# EAGLE schematic SchematicBMS_ADI (EAGLE 9.7.0)

## Sheet 1 of 2
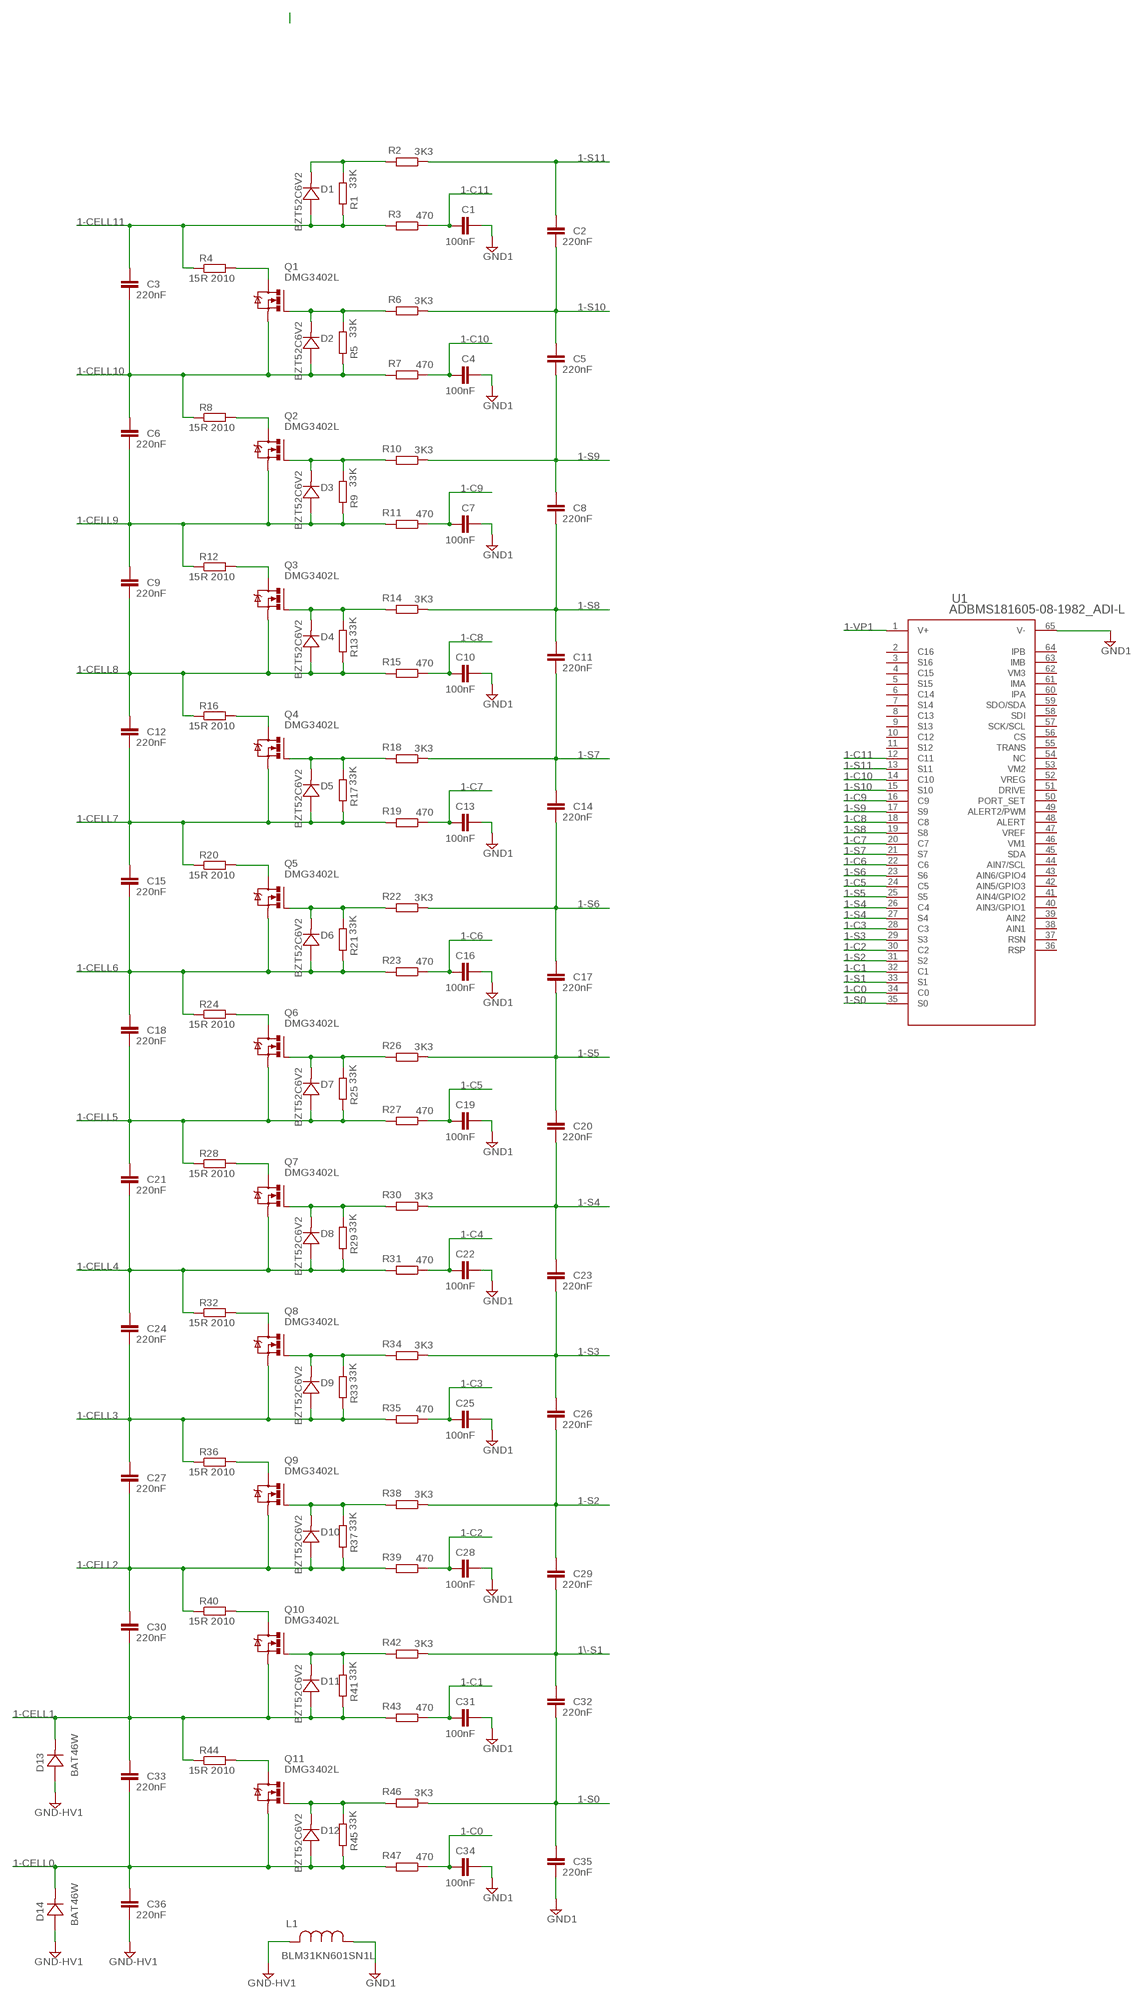
[diagram p0: schematic, sheet 1]

### Parts
C1  100nF  C-EUC0805K  [C0805K]
C2  220nF  C-EUC0805K  [C0805K]
C3  220nF  C-EUC0805K  [C0805K]
C4  100nF  C-EUC0805K  [C0805K]
C5  220nF  C-EUC0805K  [C0805K]
C6  220nF  C-EUC0805K  [C0805K]
C7  100nF  C-EUC0805K  [C0805K]
C8  220nF  C-EUC0805K  [C0805K]
C9  220nF  C-EUC0805K  [C0805K]
C10  100nF  C-EUC0805K  [C0805K]
C11  220nF  C-EUC0805K  [C0805K]
C12  220nF  C-EUC0805K  [C0805K]
C13  100nF  C-EUC0805K  [C0805K]
C14  220nF  C-EUC0805K  [C0805K]
C15  220nF  C-EUC0805K  [C0805K]
C16  100nF  C-EUC0805K  [C0805K]
C17  220nF  C-EUC0805K  [C0805K]
C18  220nF  C-EUC0805K  [C0805K]
C19  100nF  C-EUC0805K  [C0805K]
C20  220nF  C-EUC0805K  [C0805K]
C21  220nF  C-EUC0805K  [C0805K]
C22  100nF  C-EUC0805K  [C0805K]
C23  220nF  C-EUC0805K  [C0805K]
C24  220nF  C-EUC0805K  [C0805K]
C25  100nF  C-EUC0805K  [C0805K]
C26  220nF  C-EUC0805K  [C0805K]
C27  220nF  C-EUC0805K  [C0805K]
C28  100nF  C-EUC0805K  [C0805K]
C29  220nF  C-EUC0805K  [C0805K]
C30  220nF  C-EUC0805K  [C0805K]
C31  100nF  C-EUC0805K  [C0805K]
C32  220nF  C-EUC0805K  [C0805K]
C33  220nF  C-EUC0805K  [C0805K]
C34  100nF  C-EUC0805K  [C0805K]
C35  220nF  C-EUC0805K  [C0805K]
C36  220nF  C-EUC0805K  [C0805K]
D1  BZT52C6V2  BZT52C6V2-7-FSOD123_DIO  [SOD123_DIO]
D2  BZT52C6V2  BZT52C6V2-7-FSOD123_DIO  [SOD123_DIO]
D3  BZT52C6V2  BZT52C6V2-7-FSOD123_DIO  [SOD123_DIO]
D4  BZT52C6V2  BZT52C6V2-7-FSOD123_DIO  [SOD123_DIO]
D5  BZT52C6V2  BZT52C6V2-7-FSOD123_DIO  [SOD123_DIO]
D6  BZT52C6V2  BZT52C6V2-7-FSOD123_DIO  [SOD123_DIO]
D7  BZT52C6V2  BZT52C6V2-7-FSOD123_DIO  [SOD123_DIO]
D8  BZT52C6V2  BZT52C6V2-7-FSOD123_DIO  [SOD123_DIO]
D9  BZT52C6V2  BZT52C6V2-7-FSOD123_DIO  [SOD123_DIO]
D10  BZT52C6V2  BZT52C6V2-7-FSOD123_DIO  [SOD123_DIO]
D11  BZT52C6V2  BZT52C6V2-7-FSOD123_DIO  [SOD123_DIO]
D12  BZT52C6V2  BZT52C6V2-7-FSOD123_DIO  [SOD123_DIO]
D13  BAT46W  BAT46W-7-FSOD123_DIO  [SOD123_DIO]
D14  BAT46W  BAT46W-7-FSOD123_DIO  [SOD123_DIO]
L1  BLM31KN601SN1L  BLM31KN102SH1LIND_BLM31KN102SH1_MUR  [IND_BLM31KN102SH1_MUR]
Q1  DMG3402L  NMOSFETSOT23-GSD  [SOT23]
Q2  DMG3402L  NMOSFETSOT23-GSD  [SOT23]
Q3  DMG3402L  NMOSFETSOT23-GSD  [SOT23]
Q4  DMG3402L  NMOSFETSOT23-GSD  [SOT23]
Q5  DMG3402L  NMOSFETSOT23-GSD  [SOT23]
Q6  DMG3402L  NMOSFETSOT23-GSD  [SOT23]
Q7  DMG3402L  NMOSFETSOT23-GSD  [SOT23]
Q8  DMG3402L  NMOSFETSOT23-GSD  [SOT23]
Q9  DMG3402L  NMOSFETSOT23-GSD  [SOT23]
Q10  DMG3402L  NMOSFETSOT23-GSD  [SOT23]
Q11  DMG3402L  NMOSFETSOT23-GSD  [SOT23]
R1  33K  R-EU_R0805  [R0805]
R2  3K3  R-EU_R0805  [R0805]
R3  470  R-EU_R0805  [R0805]
R4  15R 2010  R-EU_R2010  [R2010]
R5  33K  R-EU_R0805  [R0805]
R6  3K3  R-EU_R0805  [R0805]
R7  470  R-EU_R0805  [R0805]
R8  15R 2010  R-EU_R2010  [R2010]
R9  33K  R-EU_R0805  [R0805]
R10  3K3  R-EU_R0805  [R0805]
R11  470  R-EU_R0805  [R0805]
R12  15R 2010  R-EU_R2010  [R2010]
R13  33K  R-EU_R0805  [R0805]
R14  3K3  R-EU_R0805  [R0805]
R15  470  R-EU_R0805  [R0805]
R16  15R 2010  R-EU_R2010  [R2010]
R17  33K  R-EU_R0805  [R0805]
R18  3K3  R-EU_R0805  [R0805]
R19  470  R-EU_R0805  [R0805]
R20  15R 2010  R-EU_R2010  [R2010]
R21  33K  R-EU_R0805  [R0805]
R22  3K3  R-EU_R0805  [R0805]
R23  470  R-EU_R0805  [R0805]
R24  15R 2010  R-EU_R2010  [R2010]
R25  33K  R-EU_R0805  [R0805]
R26  3K3  R-EU_R0805  [R0805]
R27  470  R-EU_R0805  [R0805]
R28  15R 2010  R-EU_R2010  [R2010]
R29  33K  R-EU_R0805  [R0805]
R30  3K3  R-EU_R0805  [R0805]
R31  470  R-EU_R0805  [R0805]
R32  15R 2010  R-EU_R2010  [R2010]
R33  33K  R-EU_R0805  [R0805]
R34  3K3  R-EU_R0805  [R0805]
R35  470  R-EU_R0805  [R0805]
R36  15R 2010  R-EU_R2010  [R2010]
R37  33K  R-EU_R0805  [R0805]
R38  3K3  R-EU_R0805  [R0805]
R39  470  R-EU_R0805  [R0805]
R40  15R 2010  R-EU_R2010  [R2010]
R41  33K  R-EU_R0805  [R0805]
R42  3K3  R-EU_R0805  [R0805]
R43  470  R-EU_R0805  [R0805]
R44  15R 2010  R-EU_R2010  [R2010]
R45  33K  R-EU_R0805  [R0805]
R46  3K3  R-EU_R0805  [R0805]
R47  470  R-EU_R0805  [R0805]
U1  ADBMS181605-08-1982_ADI-L  [05-08-1982_ADI-L]

### Nets
1-C0: C34.1 R47.1 U1.34(C0)
1-C1: C31.1 R43.1 U1.32(C1)
1-C2: C28.1 R39.1 U1.30(C2)
1-C3: C25.1 R35.1 U1.28(C3)
1-C4: C22.1 R31.1
1-C5: C19.1 R27.1 U1.24(C5)
1-C6: C16.1 R23.1 U1.22(C6)
1-C7: C13.1 R19.1 U1.20(C7)
1-C8: C10.1 R15.1 U1.18(C8)
1-C9: C7.1 R11.1 U1.16(C9)
1-C10: C4.1 R7.1 U1.14(C10)
1-C11: C1.1 R3.1 U1.12(C11)
1-CELL0: C33.1 C36.2 D12.2 D14.1 Q11.2(S) R45.1 R47.2
1-CELL1: C30.1 C33.2 D11.2 D13.1 Q10.2(S) R41.1 R43.2 R44.1
1-CELL2: C27.1 C30.2 D10.2 Q9.2(S) R37.1 R39.2 R40.1
1-CELL3: C24.1 C27.2 D9.2 Q8.2(S) R33.1 R35.2 R36.1
1-CELL4: C21.1 C24.2 D8.2 Q7.2(S) R29.1 R31.2 R32.1
1-CELL5: C18.1 C21.2 D7.2 Q6.2(S) R25.1 R27.2 R28.1
1-CELL6: C15.1 C18.2 D6.2 Q5.2(S) R21.1 R23.2 R24.1
1-CELL7: C12.1 C15.2 D5.2 Q4.2(S) R17.1 R19.2 R20.1
1-CELL8: C9.1 C12.2 D4.2 Q3.2(S) R13.1 R15.2 R16.1
1-CELL9: C6.1 C9.2 D3.2 Q2.2(S) R9.1 R11.2 R12.1
1-CELL10: C3.1 C6.2 D2.2 Q1.2(S) R5.1 R7.2 R8.1
1-CELL11: C3.2 D1.2 R1.1 R3.2 R4.1
1-S0: C32.1 C35.2 R46.1 U1.35(S0)
1-S1: U1.33(S1)
1-S2: C26.1 C29.2 R38.1 U1.31(S2)
1-S3: C23.1 C26.2 R34.1 U1.29(S3)
1-S4: C20.1 C23.2 R30.1 U1.26(C4) U1.27(S4)
1-S5: C17.1 C20.2 R26.1 U1.25(S5)
1-S6: C14.1 C17.2 R22.1 U1.23(S6)
1-S7: C11.1 C14.2 R18.1 U1.21(S7)
1-S8: C8.1 C11.2 R14.1 U1.19(S8)
1-S9: C5.1 C8.2 R10.1 U1.17(S9)
1-S10: C2.1 C5.2 R6.1 U1.15(S10)
1-S11: C2.2 R2.1 U1.13(S11)
1-VP1: U1.1(V+)
1\-S1: C29.1 C32.2 R42.1
GND1: C1.2 C4.2 C7.2 C10.2 C13.2 C16.2 C19.2 C22.2 C25.2 C28.2 C31.2 C34.2 C35.1 L1.1 U1.65(V-)
GND2: C36.1 D13.2 D14.2 L1.2 ; supply symbol labelled GND-HV1 ; also sheet 2
N$2: D1.1 R1.2 R2.2
N$3: Q1.3(D) R4.2
N$4: D2.1 Q1.1(G) R5.2 R6.2
N$5: Q2.3(D) R8.2
N$6: D3.1 Q2.1(G) R9.2 R10.2
N$7: Q3.3(D) R12.2
N$8: D4.1 Q3.1(G) R13.2 R14.2
N$9: Q4.3(D) R16.2
N$10: D5.1 Q4.1(G) R17.2 R18.2
N$11: Q5.3(D) R20.2
N$12: D6.1 Q5.1(G) R21.2 R22.2
N$13: Q6.3(D) R24.2
N$14: D7.1 Q6.1(G) R25.2 R26.2
N$15: Q7.3(D) R28.2
N$16: D8.1 Q7.1(G) R29.2 R30.2
N$17: Q8.3(D) R32.2
N$18: D9.1 Q8.1(G) R33.2 R34.2
N$19: Q9.3(D) R36.2
N$20: D10.1 Q9.1(G) R37.2 R38.2
N$21: Q10.3(D) R40.2
N$23: D11.1 Q10.1(G) R41.2 R42.2
N$24: Q11.3(D) R44.2
N$25: D12.1 Q11.1(G) R45.2 R46.2
Unconnected: U1.2(C16) U1.3(S16) U1.4(C15) U1.5(S15) U1.6(C14) U1.7(S14) U1.8(C13) U1.9(S13) U1.10(C12) U1.11(S12) U1.36(RSP) U1.37(RSN) U1.38(AIN1) U1.39(AIN2) U1.40(AIN3/GPIO1) U1.41(AIN4/GPIO2) U1.42(AIN5/GPIO3) U1.43(AIN6/GPIO4) U1.44(AIN7/SCL) U1.45(SDA) U1.46(VM1) U1.47(VREF) U1.48(ALERT) U1.49(ALERT2/PWM) U1.50(PORT_SET) U1.51(DRIVE) U1.52(VREG) U1.53(VM2) U1.54(NC) U1.55(TRANS) U1.56(CS) U1.57(SCK/SCL) U1.58(SDI) U1.59(SDO/SDA) U1.60(IPA) U1.61(IMA) U1.62(VM3) U1.63(IMB) U1.64(IPB)

## Sheet 2 of 2
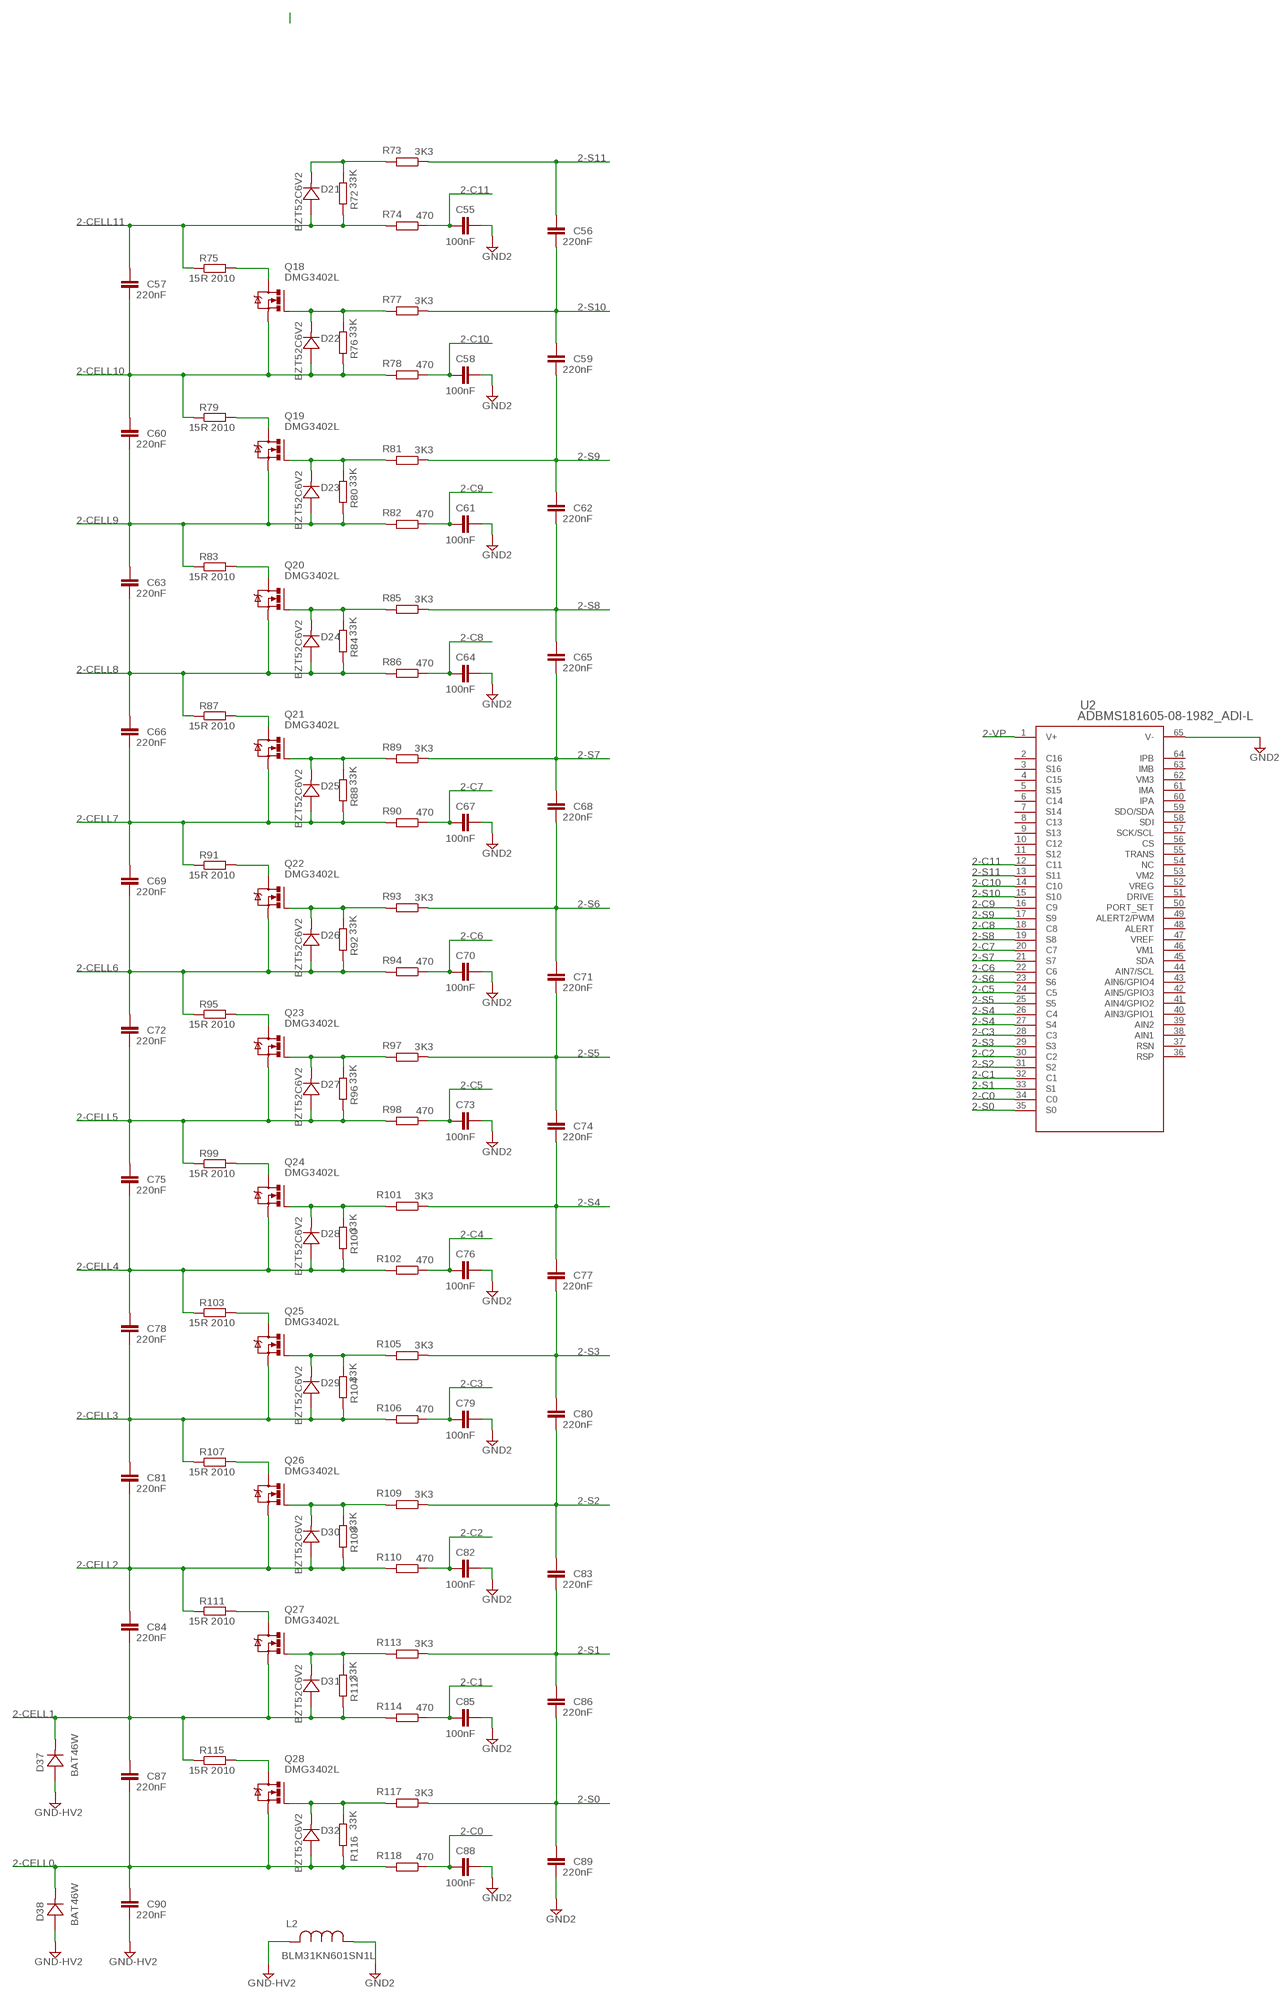
[diagram p1: schematic, sheet 2]

### Parts
C55  100nF  C-EUC0805K  [C0805K]
C56  220nF  C-EUC0805K  [C0805K]
C57  220nF  C-EUC0805K  [C0805K]
C58  100nF  C-EUC0805K  [C0805K]
C59  220nF  C-EUC0805K  [C0805K]
C60  220nF  C-EUC0805K  [C0805K]
C61  100nF  C-EUC0805K  [C0805K]
C62  220nF  C-EUC0805K  [C0805K]
C63  220nF  C-EUC0805K  [C0805K]
C64  100nF  C-EUC0805K  [C0805K]
C65  220nF  C-EUC0805K  [C0805K]
C66  220nF  C-EUC0805K  [C0805K]
C67  100nF  C-EUC0805K  [C0805K]
C68  220nF  C-EUC0805K  [C0805K]
C69  220nF  C-EUC0805K  [C0805K]
C70  100nF  C-EUC0805K  [C0805K]
C71  220nF  C-EUC0805K  [C0805K]
C72  220nF  C-EUC0805K  [C0805K]
C73  100nF  C-EUC0805K  [C0805K]
C74  220nF  C-EUC0805K  [C0805K]
C75  220nF  C-EUC0805K  [C0805K]
C76  100nF  C-EUC0805K  [C0805K]
C77  220nF  C-EUC0805K  [C0805K]
C78  220nF  C-EUC0805K  [C0805K]
C79  100nF  C-EUC0805K  [C0805K]
C80  220nF  C-EUC0805K  [C0805K]
C81  220nF  C-EUC0805K  [C0805K]
C82  100nF  C-EUC0805K  [C0805K]
C83  220nF  C-EUC0805K  [C0805K]
C84  220nF  C-EUC0805K  [C0805K]
C85  100nF  C-EUC0805K  [C0805K]
C86  220nF  C-EUC0805K  [C0805K]
C87  220nF  C-EUC0805K  [C0805K]
C88  100nF  C-EUC0805K  [C0805K]
C89  220nF  C-EUC0805K  [C0805K]
C90  220nF  C-EUC0805K  [C0805K]
D21  BZT52C6V2  BZT52C6V2-7-FSOD123_DIO  [SOD123_DIO]
D22  BZT52C6V2  BZT52C6V2-7-FSOD123_DIO  [SOD123_DIO]
D23  BZT52C6V2  BZT52C6V2-7-FSOD123_DIO  [SOD123_DIO]
D24  BZT52C6V2  BZT52C6V2-7-FSOD123_DIO  [SOD123_DIO]
D25  BZT52C6V2  BZT52C6V2-7-FSOD123_DIO  [SOD123_DIO]
D26  BZT52C6V2  BZT52C6V2-7-FSOD123_DIO  [SOD123_DIO]
D27  BZT52C6V2  BZT52C6V2-7-FSOD123_DIO  [SOD123_DIO]
D28  BZT52C6V2  BZT52C6V2-7-FSOD123_DIO  [SOD123_DIO]
D29  BZT52C6V2  BZT52C6V2-7-FSOD123_DIO  [SOD123_DIO]
D30  BZT52C6V2  BZT52C6V2-7-FSOD123_DIO  [SOD123_DIO]
D31  BZT52C6V2  BZT52C6V2-7-FSOD123_DIO  [SOD123_DIO]
D32  BZT52C6V2  BZT52C6V2-7-FSOD123_DIO  [SOD123_DIO]
D37  BAT46W  BAT46W-7-FSOD123_DIO  [SOD123_DIO]
D38  BAT46W  BAT46W-7-FSOD123_DIO  [SOD123_DIO]
L2  BLM31KN601SN1L  BLM31KN102SH1LIND_BLM31KN102SH1_MUR  [IND_BLM31KN102SH1_MUR]
Q18  DMG3402L  NMOSFETSOT23-GSD  [SOT23]
Q19  DMG3402L  NMOSFETSOT23-GSD  [SOT23]
Q20  DMG3402L  NMOSFETSOT23-GSD  [SOT23]
Q21  DMG3402L  NMOSFETSOT23-GSD  [SOT23]
Q22  DMG3402L  NMOSFETSOT23-GSD  [SOT23]
Q23  DMG3402L  NMOSFETSOT23-GSD  [SOT23]
Q24  DMG3402L  NMOSFETSOT23-GSD  [SOT23]
Q25  DMG3402L  NMOSFETSOT23-GSD  [SOT23]
Q26  DMG3402L  NMOSFETSOT23-GSD  [SOT23]
Q27  DMG3402L  NMOSFETSOT23-GSD  [SOT23]
Q28  DMG3402L  NMOSFETSOT23-GSD  [SOT23]
R72  33K  R-EU_R0805  [R0805]
R73  3K3  R-EU_R0805  [R0805]
R74  470  R-EU_R0805  [R0805]
R75  15R 2010  R-EU_R2010  [R2010]
R76  33K  R-EU_R0805  [R0805]
R77  3K3  R-EU_R0805  [R0805]
R78  470  R-EU_R0805  [R0805]
R79  15R 2010  R-EU_R2010  [R2010]
R80  33K  R-EU_R0805  [R0805]
R81  3K3  R-EU_R0805  [R0805]
R82  470  R-EU_R0805  [R0805]
R83  15R 2010  R-EU_R2010  [R2010]
R84  33K  R-EU_R0805  [R0805]
R85  3K3  R-EU_R0805  [R0805]
R86  470  R-EU_R0805  [R0805]
R87  15R 2010  R-EU_R2010  [R2010]
R88  33K  R-EU_R0805  [R0805]
R89  3K3  R-EU_R0805  [R0805]
R90  470  R-EU_R0805  [R0805]
R91  15R 2010  R-EU_R2010  [R2010]
R92  33K  R-EU_R0805  [R0805]
R93  3K3  R-EU_R0805  [R0805]
R94  470  R-EU_R0805  [R0805]
R95  15R 2010  R-EU_R2010  [R2010]
R96  33K  R-EU_R0805  [R0805]
R97  3K3  R-EU_R0805  [R0805]
R98  470  R-EU_R0805  [R0805]
R99  15R 2010  R-EU_R2010  [R2010]
R100  33K  R-EU_R0805  [R0805]
R101  3K3  R-EU_R0805  [R0805]
R102  470  R-EU_R0805  [R0805]
R103  15R 2010  R-EU_R2010  [R2010]
R104  33K  R-EU_R0805  [R0805]
R105  3K3  R-EU_R0805  [R0805]
R106  470  R-EU_R0805  [R0805]
R107  15R 2010  R-EU_R2010  [R2010]
R108  33K  R-EU_R0805  [R0805]
R109  3K3  R-EU_R0805  [R0805]
R110  470  R-EU_R0805  [R0805]
R111  15R 2010  R-EU_R2010  [R2010]
R112  33K  R-EU_R0805  [R0805]
R113  3K3  R-EU_R0805  [R0805]
R114  470  R-EU_R0805  [R0805]
R115  15R 2010  R-EU_R2010  [R2010]
R116  33K  R-EU_R0805  [R0805]
R117  3K3  R-EU_R0805  [R0805]
R118  470  R-EU_R0805  [R0805]
U2  ADBMS181605-08-1982_ADI-L  [05-08-1982_ADI-L]

### Nets
2-C0: C88.1 R118.1 U2.34(C0)
2-C1: C85.1 R114.1 U2.32(C1)
2-C2: C82.1 R110.1 U2.30(C2)
2-C3: C79.1 R106.1 U2.28(C3)
2-C4: C76.1 R102.1
2-C5: C73.1 R98.1 U2.24(C5)
2-C6: C70.1 R94.1 U2.22(C6)
2-C7: C67.1 R90.1 U2.20(C7)
2-C8: C64.1 R86.1 U2.18(C8)
2-C9: C61.1 R82.1 U2.16(C9)
2-C10: C58.1 R78.1 U2.14(C10)
2-C11: C55.1 R74.1 U2.12(C11)
2-CELL0: C87.1 C90.2 D32.2 D38.1 Q28.2(S) R116.1 R118.2
2-CELL1: C84.1 C87.2 D31.2 D37.1 Q27.2(S) R112.1 R114.2 R115.1
2-CELL2: C81.1 C84.2 D30.2 Q26.2(S) R108.1 R110.2 R111.1
2-CELL3: C78.1 C81.2 D29.2 Q25.2(S) R104.1 R106.2 R107.1
2-CELL4: C75.1 C78.2 D28.2 Q24.2(S) R100.1 R102.2 R103.1
2-CELL5: C72.1 C75.2 D27.2 Q23.2(S) R96.1 R98.2 R99.1
2-CELL6: C69.1 C72.2 D26.2 Q22.2(S) R92.1 R94.2 R95.1
2-CELL7: C66.1 C69.2 D25.2 Q21.2(S) R88.1 R90.2 R91.1
2-CELL8: C63.1 C66.2 D24.2 Q20.2(S) R84.1 R86.2 R87.1
2-CELL9: C60.1 C63.2 D23.2 Q19.2(S) R80.1 R82.2 R83.1
2-CELL10: C57.1 C60.2 D22.2 Q18.2(S) R76.1 R78.2 R79.1
2-CELL11: C57.2 D21.2 R72.1 R74.2 R75.1
2-S0: C86.1 C89.2 R117.1 U2.35(S0)
2-S1: C83.1 C86.2 R113.1 U2.33(S1)
2-S2: C80.1 C83.2 R109.1 U2.31(S2)
2-S3: C77.1 C80.2 R105.1 U2.29(S3)
2-S4: C74.1 C77.2 R101.1 U2.26(C4) U2.27(S4)
2-S5: C71.1 C74.2 R97.1 U2.25(S5)
2-S6: C68.1 C71.2 R93.1 U2.23(S6)
2-S7: C65.1 C68.2 R89.1 U2.21(S7)
2-S8: C62.1 C65.2 R85.1 U2.19(S8)
2-S9: C59.1 C62.2 R81.1 U2.17(S9)
2-S10: C56.1 C59.2 R77.1 U2.15(S10)
2-S11: C56.2 R73.1 U2.13(S11)
2-VP: U2.1(V+)
GND2: C55.2 C58.2 C61.2 C64.2 C67.2 C70.2 C73.2 C76.2 C79.2 C82.2 C85.2 C88.2 C89.1 C90.1 D37.2 D38.2 L2.1 L2.2 U2.65(V-) ; supply symbol labelled GND-HV2 ; also sheet 1
N$31: D21.1 R72.2 R73.2
N$34: Q18.3(D) R75.2
N$37: D22.1 Q18.1(G) R76.2 R77.2
N$40: Q19.3(D) R79.2
N$41: D23.1 Q19.1(G) R80.2 R81.2
N$42: Q20.3(D) R83.2
N$43: D24.1 Q20.1(G) R84.2 R85.2
N$44: Q21.3(D) R87.2
N$45: D25.1 Q21.1(G) R88.2 R89.2
N$46: Q22.3(D) R91.2
N$47: D26.1 Q22.1(G) R92.2 R93.2
N$48: Q23.3(D) R95.2
N$49: D27.1 Q23.1(G) R96.2 R97.2
N$50: Q24.3(D) R99.2
N$51: D28.1 Q24.1(G) R100.2 R101.2
N$52: Q25.3(D) R103.2
N$53: D29.1 Q25.1(G) R104.2 R105.2
N$54: Q26.3(D) R107.2
N$55: D30.1 Q26.1(G) R108.2 R109.2
N$56: Q27.3(D) R111.2
N$57: D31.1 Q27.1(G) R112.2 R113.2
N$58: Q28.3(D) R115.2
N$59: D32.1 Q28.1(G) R116.2 R117.2
Unconnected: U2.2(C16) U2.3(S16) U2.4(C15) U2.5(S15) U2.6(C14) U2.7(S14) U2.8(C13) U2.9(S13) U2.10(C12) U2.11(S12) U2.36(RSP) U2.37(RSN) U2.38(AIN1) U2.39(AIN2) U2.40(AIN3/GPIO1) U2.41(AIN4/GPIO2) U2.42(AIN5/GPIO3) U2.43(AIN6/GPIO4) U2.44(AIN7/SCL) U2.45(SDA) U2.46(VM1) U2.47(VREF) U2.48(ALERT) U2.49(ALERT2/PWM) U2.50(PORT_SET) U2.51(DRIVE) U2.52(VREG) U2.53(VM2) U2.54(NC) U2.55(TRANS) U2.56(CS) U2.57(SCK/SCL) U2.58(SDI) U2.59(SDO/SDA) U2.60(IPA) U2.61(IMA) U2.62(VM3) U2.63(IMB) U2.64(IPB)

## Library data of the parts
C1-C36 C55-C90 = rcl:C-EU: CAPACITOR, European symbol; SPICEPREFIX: C
D1-D12 D21-D32 = BZT52C6V2:BZT52C6V2-7-F; COPYRIGHT: Copyright (C) 2024 Ultra Librarian. All rights reserved.; MANUFACTURER_PART_NUMBER: BZT52C6V2-7-F; MFR_NAME: Diodes Inc
D13 D14 D37 D38 = BAT46W:BAT46W-7-F; COPYRIGHT: Copyright (C) 2024 Ultra Librarian. All rights reserved.; MANUFACTURER_PART_NUMBER: BAT46W-7-F; MFR_NAME: Diodes Inc
L1 L2 = BLM31KN:BLM31KN102SH1L; COPYRIGHT: Copyright (C) 2024 Ultra Librarian. All rights reserved.; MANUFACTURER_PART_NUMBER: BLM31KN102SH1L; MFR_NAME: Murata
Q1-Q11 Q18-Q28 = Transistor:NMOSFET: N-Channel MOSFET - Generic; CATEGORY: Transistor; SUB-CATEGORY: MOSFET; TYPE: N-Channel; VALUE: NMOSFET
R1-R47 R72-R118 = rcl:R-EU_: RESISTOR, European symbol; SPICEPREFIX: R
U1 U2 = ADBMS1816:ADBMS1816; COPYRIGHT: Copyright (C) 2024 Ultra Librarian. All rights reserved.; MANUFACTURER_PART_NUMBER: ADBMS1818ASWZ-RL; MFR_NAME: Analog Devices Inc; TYPE: Power Management